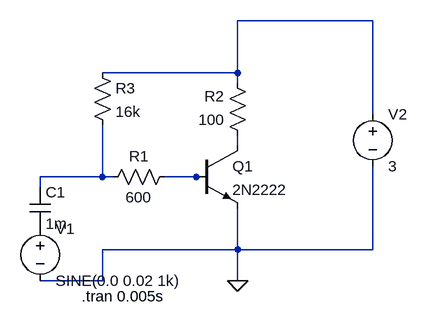
[diagram p0: schematic created.asc]
created.asc, the LTspice schematic file:
Version 4
SHEET 1 880 680
WIRE 384 -144 176 -144
WIRE 176 -64 176 -144
WIRE 176 -64 -32 -64
WIRE 176 -48 176 -64
WIRE 384 0 384 -144
WIRE 176 48 176 32
WIRE -32 96 -32 16
WIRE -32 96 -128 96
WIRE -16 96 -32 96
WIRE 112 96 64 96
WIRE 128 96 112 96
WIRE -128 112 -128 96
WIRE 176 208 176 144
WIRE 176 208 -32 208
WIRE 384 208 384 80
WIRE 384 208 176 208
WIRE -32 256 -32 208
WIRE -32 256 -128 256
WIRE 176 256 176 208
FLAG 176 256 0
DATAFLAG 176 256 ""
SYMBOL npn 112 48 R0
SYMATTR InstName Q1
SYMATTR Value 2N2222
SYMBOL voltage -128 160 R0
WINDOW 123 0 0 Left 0
WINDOW 39 0 0 Left 0
SYMATTR InstName V1
SYMATTR Value SINE(0.0 0.02 1k)
SYMBOL res 192 48 R180
WINDOW 0 36 76 Left 2
WINDOW 3 36 40 Left 2
SYMATTR InstName R2
SYMATTR Value 100
SYMBOL voltage 384 -16 R0
WINDOW 123 0 0 Left 0
WINDOW 39 0 0 Left 0
SYMATTR InstName V2
SYMATTR Value 3
SYMBOL res 80 80 R90
WINDOW 0 0 56 VBottom 2
WINDOW 3 32 56 VTop 2
SYMATTR InstName R1
SYMATTR Value 600
SYMATTR SpiceLine tol=600
SYMBOL res -48 -80 R0
SYMATTR InstName R3
SYMATTR Value 16k
SYMBOL cap -144 112 R0
SYMATTR InstName C1
SYMATTR Value 1m
TEXT -64 280 Left 2 !.tran 0.005s

The netlist it stands for:
* created.asc
Q1 N002 N004 0 0 2N2222
V1 P001 0 SINE(0.0 0.02 1k)
R2 N002 N001 100
V2 N001 0 3
R1 N004 N003 600 tol=600
R3 N001 N003 16k
C1 N003 P001 1m
.model NPN NPN
.model PNP PNP
.lib standard.bjt
.tran 0.005s
.backanno
.end